# Altium schematic sheet SH2 - CONNECTORS.SchDoc
size B
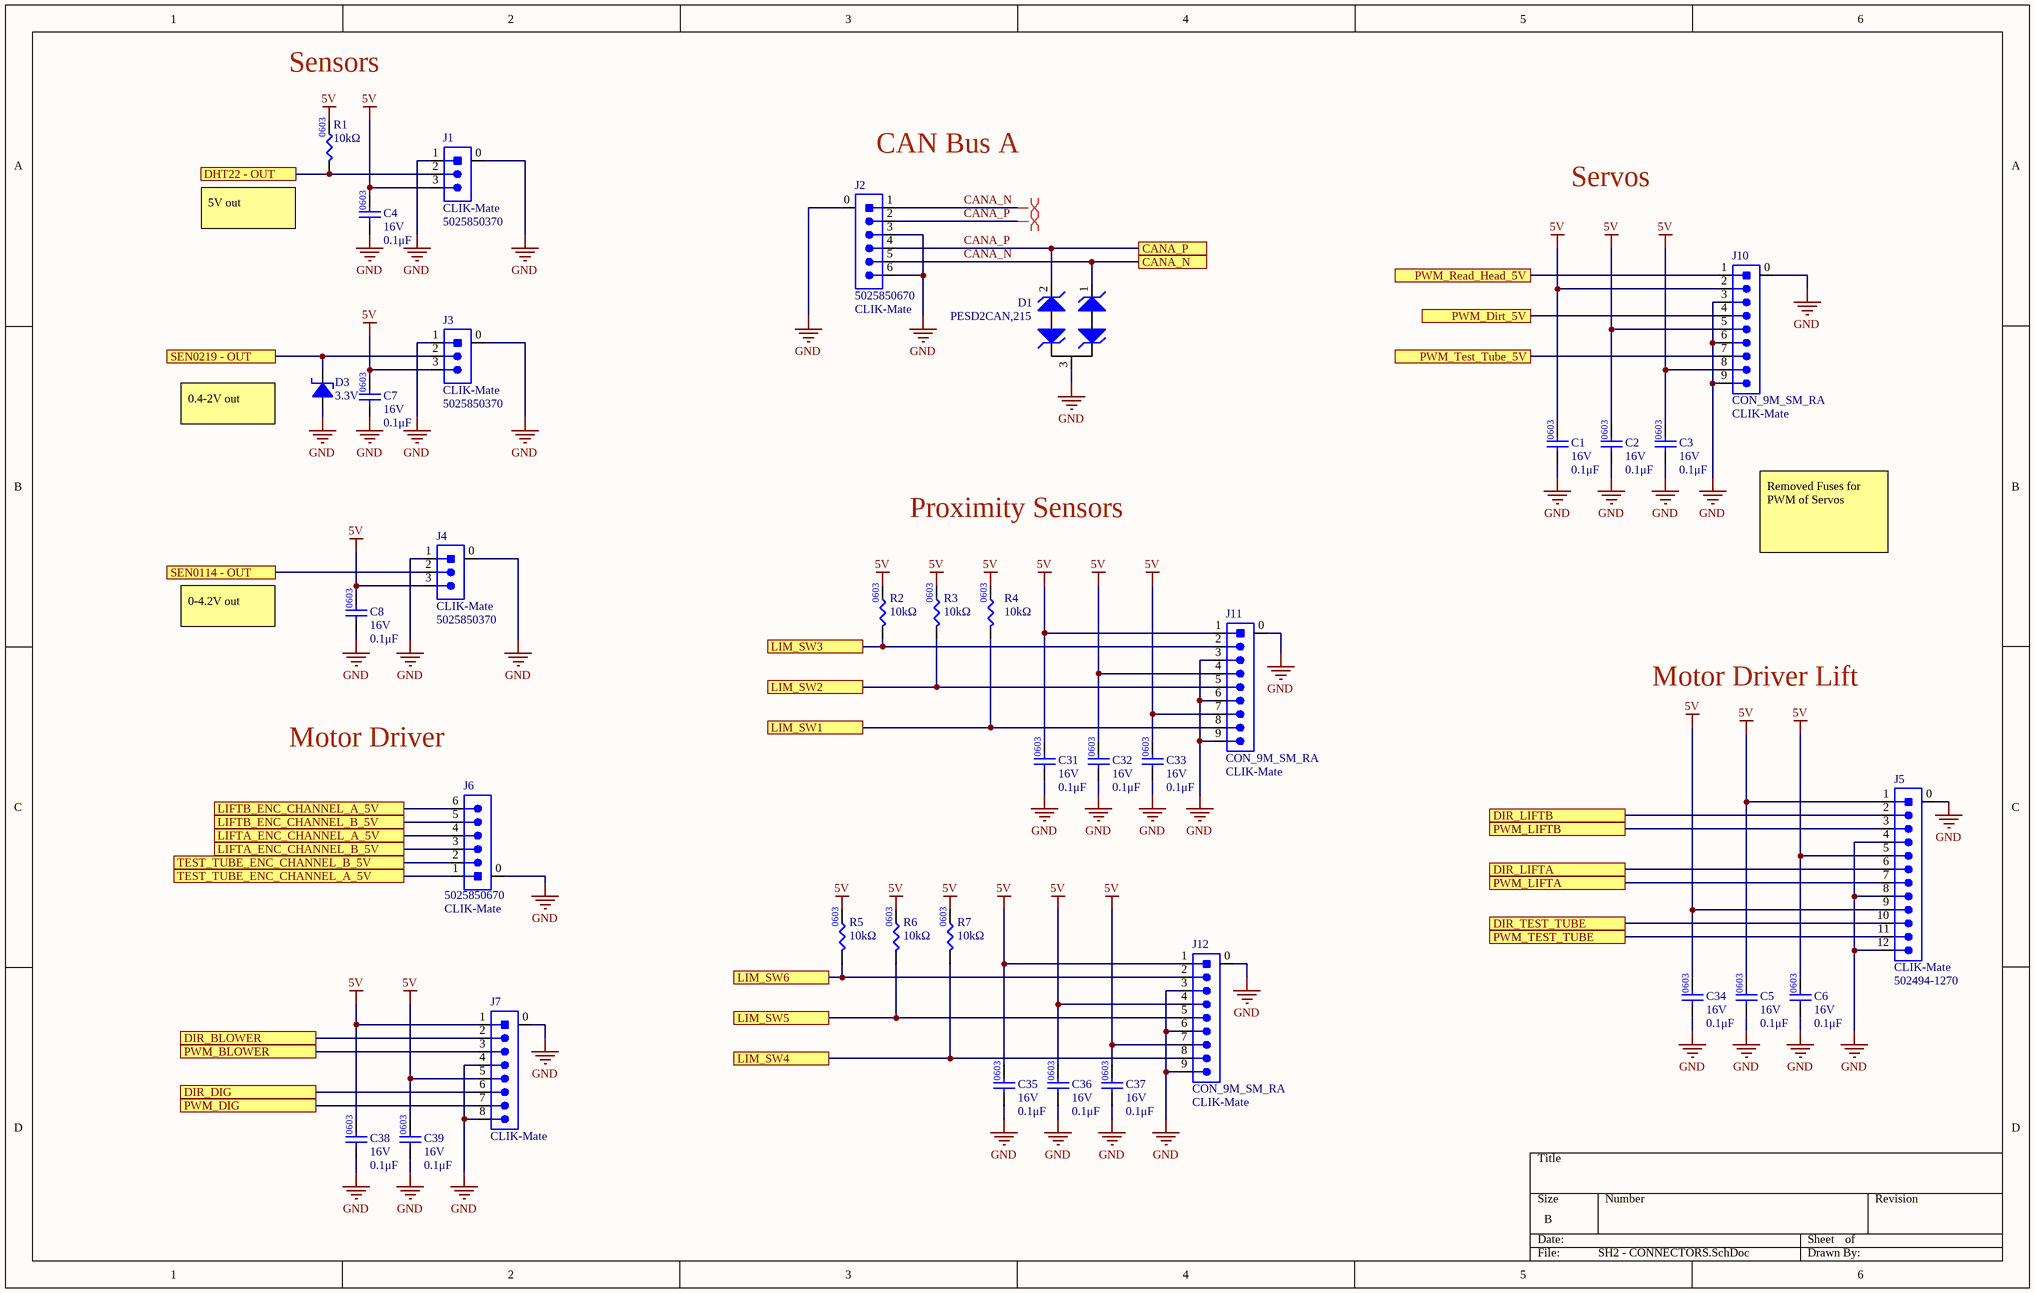
[diagram p0: SH2 - CONNECTORS.SchDoc]

## Parts
C1  value 0.1μF  Voltage Rating: 16V  [CAP0603]  (hidden comment: CAP_0.1uF_16V_0603)
C2  value 0.1μF  Voltage Rating: 16V  [CAP0603]  (hidden comment: CAP_0.1uF_16V_0603)
C3  value 0.1μF  Voltage Rating: 16V  [CAP0603]  (hidden comment: CAP_0.1uF_16V_0603)
C4  value 0.1μF  Voltage Rating: 16V  [CAP0603]  (hidden comment: CAP_0.1uF_16V_0603)
C5  value 0.1μF  Voltage Rating: 16V  [CAP0603]  (hidden comment: CAP_0.1uF_16V_0603)
C6  value 0.1μF  Voltage Rating: 16V  [CAP0603]  (hidden comment: CAP_0.1uF_16V_0603)
C7  value 0.1μF  Voltage Rating: 16V  [CAP0603]  (hidden comment: CAP_0.1uF_16V_0603)
C8  value 0.1μF  Voltage Rating: 16V  [CAP0603]  (hidden comment: CAP_0.1uF_16V_0603)
C31  value 0.1μF  Voltage Rating: 16V  [CAP0603]  (hidden comment: CAP_0.1uF_16V_0603)
C32  value 0.1μF  Voltage Rating: 16V  [CAP0603]  (hidden comment: CAP_0.1uF_16V_0603)
C33  value 0.1μF  Voltage Rating: 16V  [CAP0603]  (hidden comment: CAP_0.1uF_16V_0603)
C34  value 0.1μF  Voltage Rating: 16V  [CAP0603]  (hidden comment: CAP_0.1uF_16V_0603)
C35  value 0.1μF  Voltage Rating: 16V  [CAP0603]  (hidden comment: CAP_0.1uF_16V_0603)
C36  value 0.1μF  Voltage Rating: 16V  [CAP0603]  (hidden comment: CAP_0.1uF_16V_0603)
C37  value 0.1μF  Voltage Rating: 16V  [CAP0603]  (hidden comment: CAP_0.1uF_16V_0603)
C38  value 0.1μF  Voltage Rating: 16V  [CAP0603]  (hidden comment: CAP_0.1uF_16V_0603)
C39  value 0.1μF  Voltage Rating: 16V  [CAP0603]  (hidden comment: CAP_0.1uF_16V_0603)
D1  Manufacturer Part Number 1: PESD2CAN,215  [TVS_DIODE_CAN]  (hidden comment: TVS_DIODE_CAN)
D3  Working Voltage: 3.3V  [DIO_ZENER_3V3]  (hidden comment: DIO_ZENER_3V3)
J1  Family: CLIK-Mate  Manufacturer Part Number 1: 5025850370  [MOLEX-5025850370]  (hidden comment: CON_3M_SM_RA)
J2  Manufacturer Part Number 1: 5025850670  Family: CLIK-Mate  [MOLEX-5025850670]  (hidden comment: CON_6M_SM_RA_1.5mm)
J3  Family: CLIK-Mate  Manufacturer Part Number 1: 5025850370  [MOLEX-5025850370]  (hidden comment: CON_3M_SM_RA)
J4  Family: CLIK-Mate  Manufacturer Part Number 1: 5025850370  [MOLEX-5025850370]  (hidden comment: CON_3M_SM_RA)
J5  Family: CLIK-Mate  Supplier Part Number 1: 502494-1270  [MOLEX-5024941270]  (hidden comment: CON_12M_SM_RA_2mm)
J6  Manufacturer Part Number 1: 5025850670  Family: CLIK-Mate  [MOLEX-5025850670]  (hidden comment: CON_6M_SM_RA_1.5mm)
J7  Family: CLIK-Mate  [5024430870]  (hidden comment: CON_8M_SM_RA)
J10  CON_9M_SM_RA  Family: CLIK-Mate  [Molex-5025850970]
J11  CON_9M_SM_RA  Family: CLIK-Mate  [Molex-5025850970]
J12  CON_9M_SM_RA  Family: CLIK-Mate  [Molex-5025850970]
R1  value 10kΩ  [RES0603]  (hidden comment: RES_10kΩ_0603_5%)
R2  value 10kΩ  [RES0603]  (hidden comment: RES_10kΩ_0603_5%)
R3  value 10kΩ  [RES0603]  (hidden comment: RES_10kΩ_0603_5%)
R4  value 10kΩ  [RES0603]  (hidden comment: RES_10kΩ_0603_5%)
R5  value 10kΩ  [RES0603]  (hidden comment: RES_10kΩ_0603_5%)
R6  value 10kΩ  [RES0603]  (hidden comment: RES_10kΩ_0603_5%)
R7  value 10kΩ  [RES0603]  (hidden comment: RES_10kΩ_0603_5%)

## Ports
CANA_N, CANA_P, DHT22 - OUT, DIR_BLOWER, DIR_DIG, DIR_LIFTA, DIR_LIFTB, DIR_TEST_TUBE, LIFTA_ENC_CHANNEL_A_5V, LIFTA_ENC_CHANNEL_B_5V, LIFTB_ENC_CHANNEL_A_5V, LIFTB_ENC_CHANNEL_B_5V, LIM_SW1, LIM_SW2, LIM_SW3, LIM_SW4, LIM_SW5, LIM_SW6, PWM_BLOWER, PWM_DIG, PWM_Dirt_5V, PWM_LIFTA, PWM_LIFTB, PWM_Read_Head_5V, PWM_TEST_TUBE, PWM_Test_Tube_5V, SEN0114 - OUT, SEN0219 - OUT, TEST_TUBE_ENC_CHANNEL_A_5V, TEST_TUBE_ENC_CHANNEL_B_5V

## Nets
5V: C1.2 C2.2 C3.2 C4.2 C5.2 C6.2 C7.2 C8.2 C31.2 C32.2 C33.2 C34.2 C35.2 C36.2 C37.2 C38.2 C39.2 J1.3 J3.3 J4.3 J5.1 J5.5 J5.9 J7.1 J7.5 J10.2 J10.5 J10.8 J11.1 J11.4 J11.7 J12.1 J12.4 J12.7 R1.2 R2.2 R3.2 R4.2 R5.2 R6.2 R7.2
GND: C1.1 C2.1 C3.1 C4.1 C5.1 C6.1 C7.1 C8.1 C31.1 C32.1 C33.1 C34.1 C35.1 C36.1 C37.1 C38.1 C39.1 D1.3 D3.1(Anode) J1.0 J1.1 J2.0 J2.3 J2.6 J3.0 J3.1 J4.0 J4.1 J5.0 J5.4 J5.8 J5.12 J6.0 J7.0 J7.4 J7.8 J10.0 J10.3 J10.6 J10.9 J11.0 J11.3 J11.6 J11.9 J12.0 J12.3 J12.6 J12.9
CANA_N: D1.1 J2.1 J2.5 ; port CANA_N
CANA_P: D1.2 J2.2 J2.4 ; port CANA_P
DHT22 - OUT: J1.2 R1.1 ; port DHT22 - OUT
DIR_BLOWER: J7.2 ; port DIR_BLOWER
DIR_DIG: J7.6 ; port DIR_DIG
DIR_LIFTA: J5.6 ; port DIR_LIFTA
DIR_LIFTB: J5.2 ; port DIR_LIFTB
DIR_TEST_TUBE: J5.10 ; port DIR_TEST_TUBE
LIFTA_ENC_CHANNEL_A_5V: J6.4 ; port LIFTA_ENC_CHANNEL_A_5V
LIFTA_ENC_CHANNEL_B_5V: J6.3 ; port LIFTA_ENC_CHANNEL_B_5V
LIFTB_ENC_CHANNEL_A_5V: J6.6 ; port LIFTB_ENC_CHANNEL_A_5V
LIFTB_ENC_CHANNEL_B_5V: J6.5 ; port LIFTB_ENC_CHANNEL_B_5V
LIM_SW1: J11.8 R4.1 ; port LIM_SW1
LIM_SW2: J11.5 R3.1 ; port LIM_SW2
LIM_SW3: J11.2 R2.1 ; port LIM_SW3
LIM_SW4: J12.8 R7.1 ; port LIM_SW4
LIM_SW5: J12.5 R6.1 ; port LIM_SW5
LIM_SW6: J12.2 R5.1 ; port LIM_SW6
PWM_BLOWER: J7.3 ; port PWM_BLOWER
PWM_DIG: J7.7 ; port PWM_DIG
PWM_Dirt_5V: J10.4 ; port PWM_Dirt_5V
PWM_LIFTA: J5.7 ; port PWM_LIFTA
PWM_LIFTB: J5.3 ; port PWM_LIFTB
PWM_Read_Head_5V: J10.1 ; port PWM_Read_Head_5V
PWM_TEST_TUBE: J5.11 ; port PWM_TEST_TUBE
PWM_Test_Tube_5V: J10.7 ; port PWM_Test_Tube_5V
SEN0114 - OUT: J4.2 ; port SEN0114 - OUT
SEN0219 - OUT: D3.2(Cathode) J3.2 ; port SEN0219 - OUT
TEST_TUBE_ENC_CHANNEL_A_5V: J6.1 ; port TEST_TUBE_ENC_CHANNEL_A_5V
TEST_TUBE_ENC_CHANNEL_B_5V: J6.2 ; port TEST_TUBE_ENC_CHANNEL_B_5V

## Layout directives
differential pair: CANA_N, CANA_P

## Notes on the sheet
- Sensors
- (near J2) CAN Bus A
- (near R1) 5V out
- Servos
- (near D3) 0.4-2V out
- Proximity Sensors
- Removed Fuses for PWM of Servos
- 0-4.2V out
- Motor Driver Lift
- Motor Driver

## Library data of the parts
C1-C8 C31-C39 = CAP_0.1uF_16V_0603: CAP CER 0.1UF 16V X7R 0603; Manufacturer Part Number 1: CC0603KRX7R7BB104; Manufacturer 1: Yageo; Package: 0603; Supplier Part Number 1: 311-1088-1-ND; Supplier 1: Digi-Key; Dielectric: X7R
D1 = TVS_DIODE_CAN: TVS DIODE 24V 41V SOT323-3; Manufacturer 1: Nexperia USA Inc.; Voltage - Breakdown (Min): 26.2V; Supplier Part Number 1: 1727-3891-1-ND; Supplier 1: Digi-Key; Package/Footprint: SOT323-3; Mounting Type: SMD; Verified: Yes; Voltage - Reverse Standoff (Typ): 24V; Voltage - Clamping (Max) @ Ipp: 41V
D3 = DIO_ZENER_3V3: DIODE ZENER 3.3V 200mW SOD323F; Manufacturer 1: ON Semiconductor / Fairchild; Manufacturer Part Number 1: MM3Z3V3B; Forward Voltage: 1V; Supplier Part Number 1: MM3Z3V3BCT-ND; Supplier 1: Digi-Key; Package/Case: SOD323F
J1 J3 J4 = CON_3M_SM_RA: CONN RCPT 3POS 0.059 TIN SMD R/A; Manufacturer 1: Molex; Current Rating: 2A; Voltage Rating: 100V; Pitch: 1.5mm; Supplier 1: Digi-Key; Mounting Type: SMD; Package/Footprint: SMD; Orientation: Right Angle; Supplier Part Number 1: WM12831CT-ND
J2 J6 = CON_6M_SM_RA_1.5mm: CONN HEADER SMD RIGHT ANGLE 1.5 MM PITCH; Manufacturer 1: Molex; Supplier 1: Digi-Key; Supplier Part Number 1: WM12832CT-ND; Package/Footprint: SMD; Mounting Type: SMD
J5 = CON_12M_SM_RA_2mm: 2.00mm Pitch CLIK-Mate Wire-to-Board PCB Receptacle, Single Row, Right-Angle, 12 Circuits; Manufacturer: Molex; Number of Contacts: 12; Contact Resistance: 20mR; Current Rating: 3A; Mating Cycles: 30; Voltage Rating (AC): 250V; Insulation Resistance: 1GR; Pitch: 2mm; Glow Wire Compliant: Non-compliant; Supplier 1: Mouser; Manufacturer Part Number: 502494-1270; RoHS: Yes; Category: Headers and Wire Housings; Stock 1: 1900; Pricing 1: 950=0.62780, 1900=0.61060, 3800=0.56580, 5700=0.53600, 7600=0.52000 (USD); Mount: Surface Mount; Color: Natural,White; Contact Plating: Tin; Contact Material: Copper Alloy; Housing Material: PBT; Material: Polybutylene; Housing Color: Natural; Min Operating Temperature: -25°C; Max Operating Temperature: 85°C; Number of Rows: 1; Termination: Solder; Fastening Type: Latch; Packaging: Tape and Reel; Contact Gender: Female; Package Quantity: 950; Connector Type: Receptacle; Number of Positions: 12; Max Voltage Rating (AC): 250V; Max Voltage Rating (DC): 250V; Gender: Receptacle; Orientation: Right Angle; Number of Circuits: 12; Series: 502494; Contact Type: Center Strip Contact; Length: 28mm; Lead Pitch: 2mm; Depth: 6.85mm; Radiation Hardening: No; REACH SVHC: Unknown; Flammability Rating: UL94 V-0
J7 = CON_8M_SM: CONN HEADER SMD VERTICAL 2 MM PITCH; Current Rating: 3A; Voltage Rating: 250V; Pitch: 1.5mm; Supplier 1: Digi-Key; Mounting Type: SMD; Package/Footprint: SMD; Orientation: Right Angle; Supplier Part Number 1: WM14471CT-ND
J10-J12 = CON_9M_SM_RA: CONN RCPT 9POS CLIK-MATE 0.059 TIN SMD R/A; Current Rating: 2A; Pitch: 1.5mm; Supplier 1: Digi-Key; Orientation: Right Angle; Supplier Part Number 1: WM20816CT-ND
R1-R7 = RES_10kΩ_0603_5%: RES 10K OHM 5% 1/10W 0603; Manufacturer 1: Yageo; Manufacturer Part Number 1: RC0603JR-0710KL; Supplier Part Number 1: 311-10KGRCT-ND; Supplier 1: Digi-Key; Mounting Type: SMD; Package: 0603